# EAGLE schematic HomeHeat (EAGLE 9.6.2)
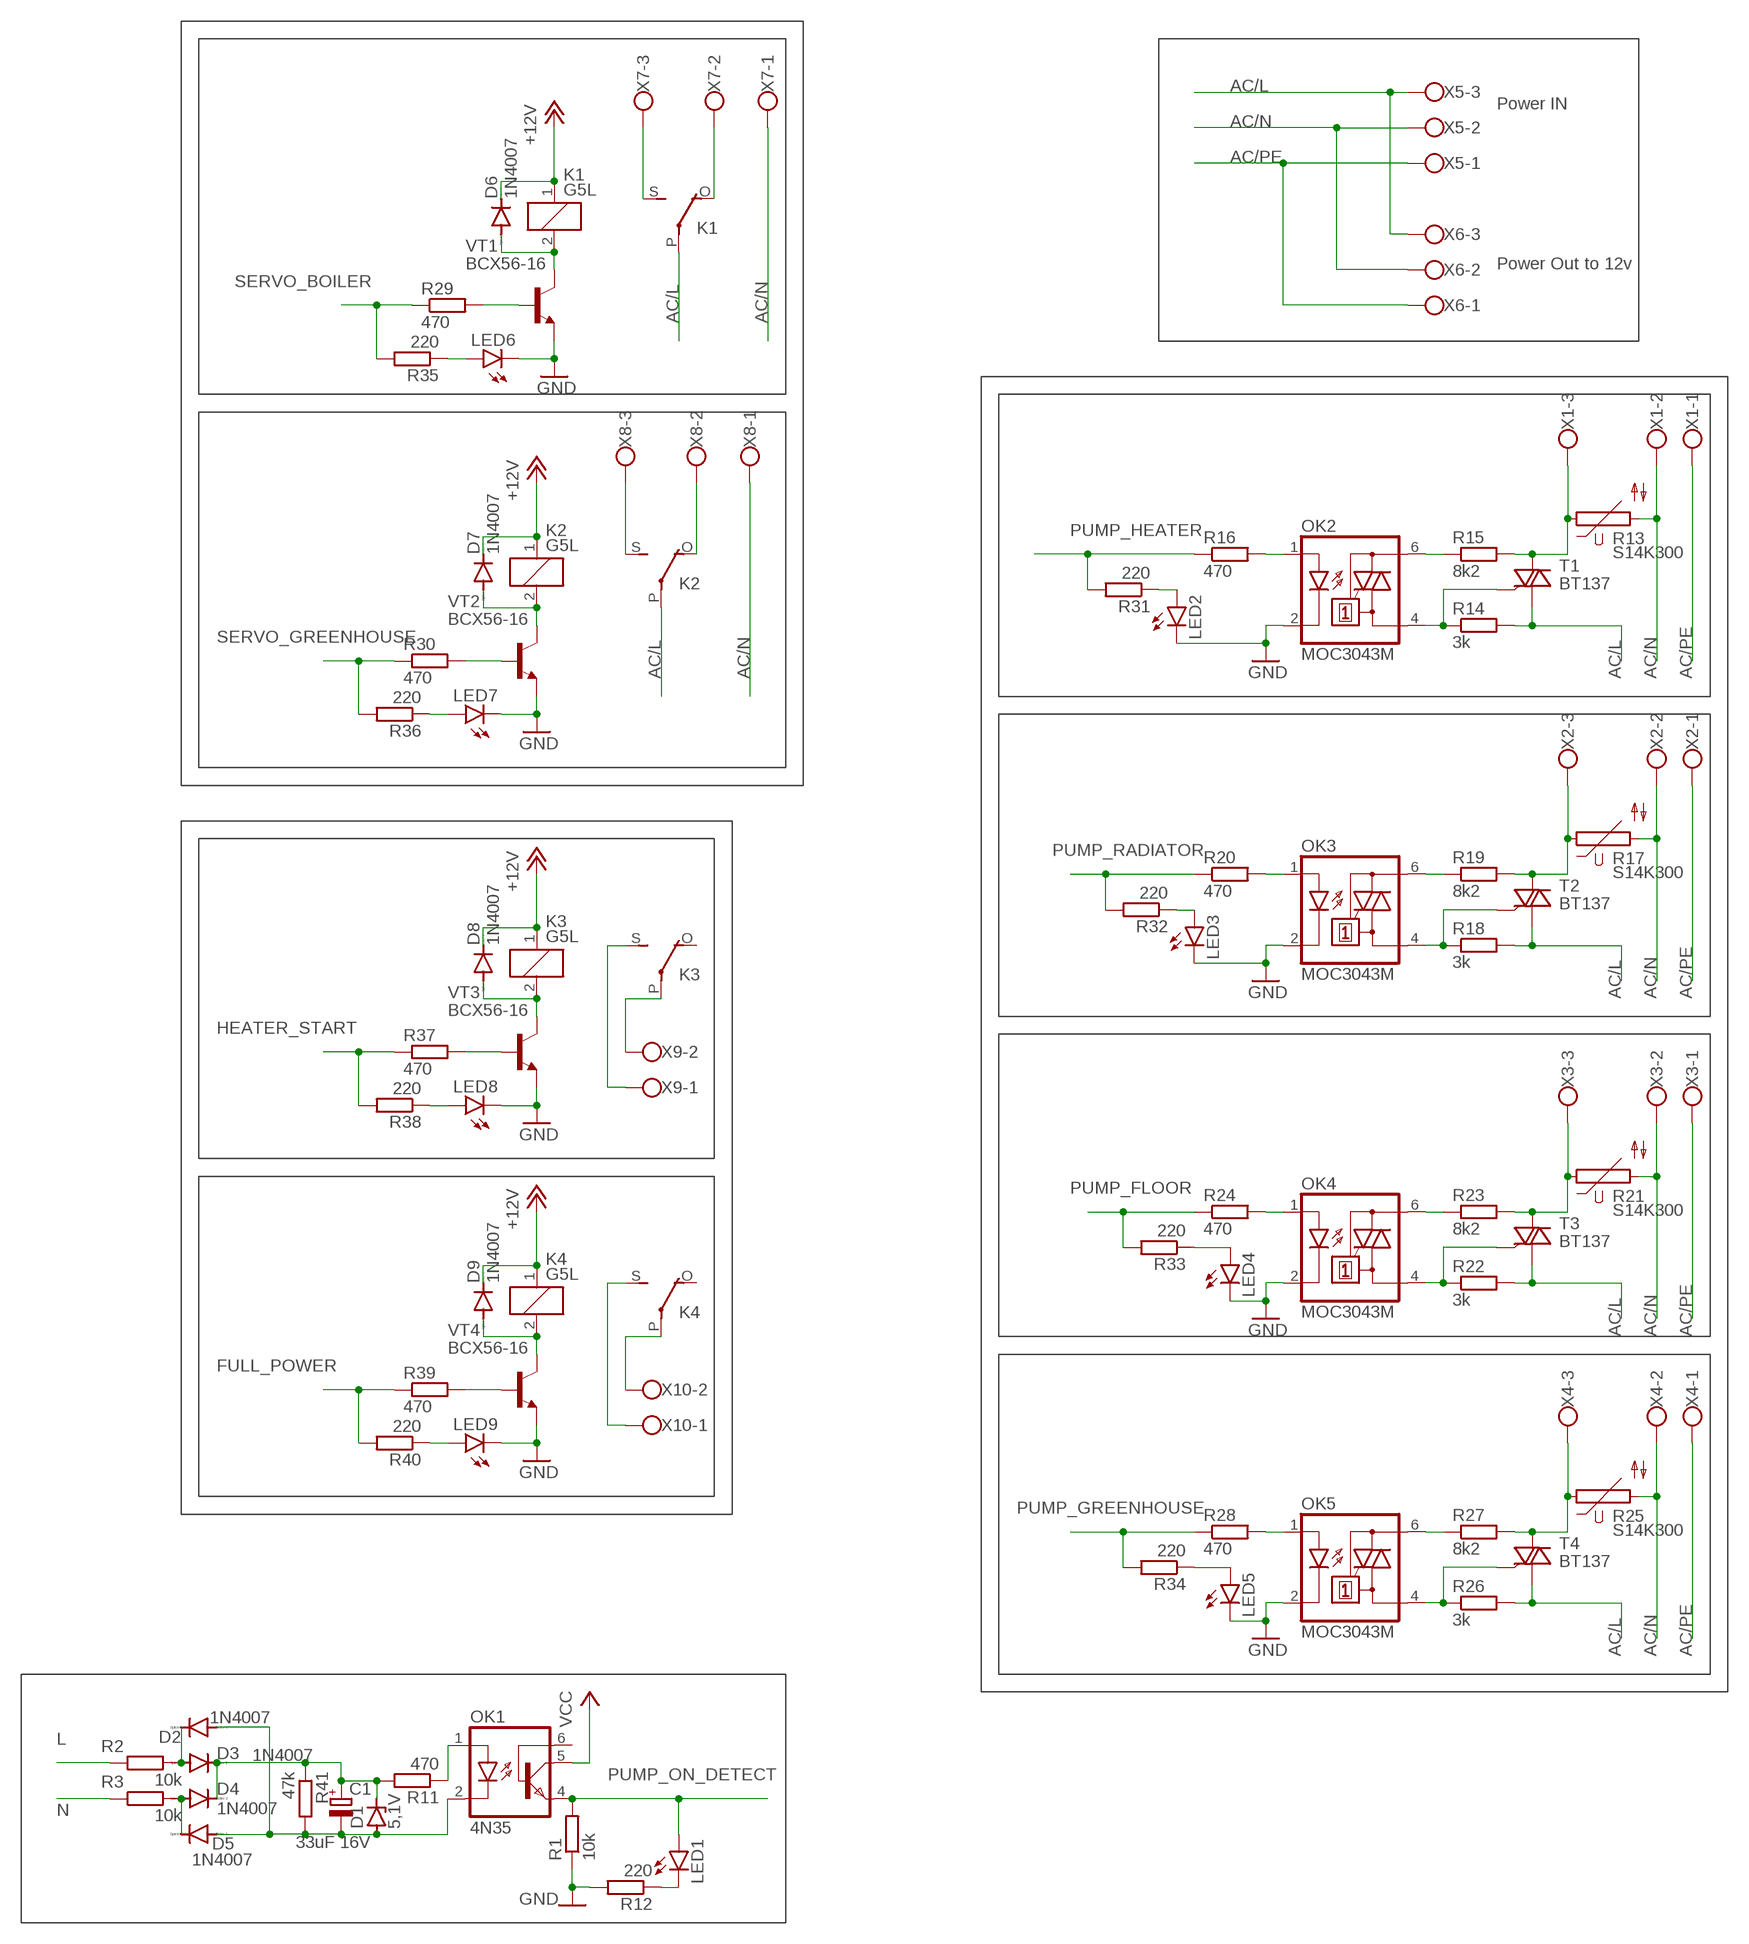
[diagram p0: schematic, sheet 1]

## Parts
C1  33uF 16V  CPOL-EUSMCA  [SMC_A]
D1  5,1V  ZENER-DIODEDO41Z10  [DO41Z10]
D2  1N4007  1N4004  [DO41-10]
D3  1N4007  1N4004  [DO41-10]
D4  1N4007  1N4004  [DO41-10]
D5  1N4007  1N4004  [DO41-10]
D6  1N4007  1N4004  [DO41-10]
D7  1N4007  1N4004  [DO41-10]
D8  1N4007  1N4004  [DO41-10]
D9  1N4007  1N4004  [DO41-10]
K1  G5L  [G5LE]
K2  G5L  [G5LE]
K3  G5L  [G5LE]
K4  G5L  [G5LE]
LED1  LEDCHIP-LED0805  [CHIP-LED0805]
LED2  LEDCHIP-LED0805  [CHIP-LED0805]
LED3  LEDCHIP-LED0805  [CHIP-LED0805]
LED4  LEDCHIP-LED0805  [CHIP-LED0805]
LED5  LEDCHIP-LED0805  [CHIP-LED0805]
LED6  LEDCHIP-LED0805  [CHIP-LED0805]
LED7  LEDCHIP-LED0805  [CHIP-LED0805]
LED8  LEDCHIP-LED0805  [CHIP-LED0805]
LED9  LEDCHIP-LED0805  [CHIP-LED0805]
OK1  4N35  [DIL06]
OK2  MOC3043M  [DIL06]
OK3  MOC3043M  [DIL06]
OK4  MOC3043M  [DIL06]
OK5  MOC3043M  [DIL06]
R1  10k  R-EU_R0805  [R0805]
R2  10k  R-EU_0922/22  [0922/22]
R3  10k  R-EU_0922/22  [0922/22]
R11  470  R-EU_R0805  [R0805]
R12  220  R-EU_R0805  [R0805]
R13  S14K300  [S14K300]
R14  3k  R-EU_0207/7  [0207/7]
R15  8k2  R-EU_0207/7  [0207/7]
R16  470  R-EU_R0805  [R0805]
R17  S14K300  [S14K300]
R18  3k  R-EU_0207/7  [0207/7]
R19  8k2  R-EU_0207/7  [0207/7]
R20  470  R-EU_R0805  [R0805]
R21  S14K300  [S14K300]
R22  3k  R-EU_0207/7  [0207/7]
R23  8k2  R-EU_0207/7  [0207/7]
R24  470  R-EU_R0805  [R0805]
R25  S14K300  [S14K300]
R26  3k  R-EU_0207/7  [0207/7]
R27  8k2  R-EU_0207/7  [0207/7]
R28  470  R-EU_R0805  [R0805]
R29  470  R-EU_R0805  [R0805]
R30  470  R-EU_R0805  [R0805]
R31  220  R-EU_R0805  [R0805]
R32  220  R-EU_R0805  [R0805]
R33  220  R-EU_R0805  [R0805]
R34  220  R-EU_R0805  [R0805]
R35  220  R-EU_R0805  [R0805]
R36  220  R-EU_R0805  [R0805]
R37  470  R-EU_R0805  [R0805]
R38  220  R-EU_R0805  [R0805]
R39  470  R-EU_R0805  [R0805]
R40  220  R-EU_R0805  [R0805]
R41  47k  R-EU_R0805  [R0805]
T1  BT137  BT136  [TO220AB]
T2  BT137  BT136  [TO220AB]
T3  BT137  BT136  [TO220AB]
T4  BT137  BT136  [TO220AB]
VT1  BCX56-16  [SOT89-BCE]
VT2  BCX56-16  [SOT89-BCE]
VT3  BCX56-16  [SOT89-BCE]
VT4  BCX56-16  [SOT89-BCE]
X1  W237-103  [W237-103]
X2  W237-103  [W237-103]
X3  W237-103  [W237-103]
X4  W237-103  [W237-103]
X5  W237-103  [W237-103]
X6  W237-103  [W237-103]
X7  W237-103  [W237-103]
X8  W237-103  [W237-103]
X9  W237-102  [W237-102]
X10  W237-102  [W237-102]

## Nets
+12V: D6.C D7.C D8.C D9.C K1.1 K2.1 K3.1 K4.1
AC/L: K1.P(2:P) K2.P(2:P) R14.2 R18.2 R22.2 R26.2 T1.1(A1) T2.1(A1) T3.1(A1) T4.1(A1) X5.3 X6.3
AC/N: R13.2 R17.2 R21.2 R25.2 X1.2 X2.2 X3.2 X4.2 X5.2 X6.2 X7.1 X8.1
AC/PE: X1.1 X2.1 X3.1 X4.1 X5.1 X6.1
FULL_POWER: R39.1 R40.2
GND: LED2.C LED3.C LED4.C LED5.C LED6.C LED7.C LED8.C LED9.C OK2.2(C) OK3.2(C) OK4.2(C) OK5.2(C) R1.1 R12.2 VT1.E VT2.E VT3.E VT4.E
HEATER_START: R37.1 R38.2
N$1: R2.1
N$2: R3.1
N$5: LED1.C R12.1
N$7: D2.C D3.A R2.2
N$8: D4.A D5.C R3.2
N$9: C1.- D1.A D2.A D5.A OK1.2(C) R41.2
N$10: C1.+ D1.C D3.C D4.C R11.2 R41.1
N$11: OK1.1(A) R11.1
N$13: D8.A K3.2 VT3.C VT3.C@1(C)
N$17: OK2.1(A) R16.2
N$18: OK2.6(A2) R15.1
N$19: R13.1 R15.2 T1.2(A2) X1.3
N$20: OK2.4(A1) R14.1 T1.3(G)
N$21: D6.A K1.2 VT1.C VT1.C@1(C)
N$22: OK3.1(A) R20.2
N$23: OK3.6(A2) R19.1
N$24: R17.1 R19.2 T2.2(A2) X2.3
N$25: OK3.4(A1) R18.1 T2.3(G)
N$26: R29.2 VT1.B
N$27: OK4.1(A) R24.2
N$28: OK4.6(A2) R23.1
N$29: R21.1 R23.2 T3.2(A2) X3.3
N$30: OK4.4(A1) R22.1 T3.3(G)
N$31: LED2.A R31.1
N$32: OK5.1(A) R28.2
N$33: OK5.6(A2) R27.1
N$34: R25.1 R27.2 T4.2(A2) X4.3
N$35: OK5.4(A1) R26.1 T4.3(G)
N$36: D7.A K2.2 VT2.C VT2.C@1(C)
N$37: K1.S(2:S) X7.3
N$38: K1.O(2:O) X7.2
N$39: R30.2 VT2.B
N$40: LED3.A R32.1
N$41: K2.S(2:S) X8.3
N$42: K2.O(2:O) X8.2
N$43: LED4.A R33.1
N$44: LED5.A R34.1
N$45: LED6.A R35.1
N$46: LED7.A R36.1
N$47: R37.2 VT3.B
N$48: K3.P(2:P) X9.2
N$49: K3.S(2:S) X9.1
N$50: LED8.A R38.1
N$51: D9.A K4.2 VT4.C VT4.C@1(C)
N$52: R39.2 VT4.B
N$53: LED9.A R40.1
N$54: K4.P(2:P) X10.2
N$55: K4.S(2:S) X10.1
PUMP_FLOOR: R24.1 R33.2
PUMP_GREENHOUSE: R28.1 R34.2
PUMP_HEATER: R16.1 R31.2
PUMP_ON_DETECT: LED1.A OK1.4(EMI) R1.2
PUMP_RADIATOR: R20.1 R32.2
SERVO_BOILER: R29.1 R35.2
SERVO_GREENHOUSE: R30.1 R36.2
VCC: OK1.5(COL)
Unconnected: K3.O(2:O) K4.O(2:O) OK1.6(BAS)

## Notes on the sheet
- Power IN
- Power Out to 12v
- L
- N

## Library data of the parts
C1 = rcl:CPOL-EU: POLARIZED CAPACITOR, European symbol; SPICEPREFIX: C
D1 = diode:ZENER-DIODE: Z-Diode
D2 D3 D5-D9 = diode:1N4004: DIODE general purpose rectifier, 1 A
D4 = diode:1N4004: DIODE general purpose rectifier, 1 A; SPICEPREFIX: D
K1-K4 = relay:G5L: RELAY 1 x switch, 10 A/120 V AC, 8 A/30 V ADC, Omron; OC_FARNELL: unknown; OC_NEWARK: unknown
LED1-LED9 = led:LED: LED OSRAM: - CHIPLED LG R971, LG N971, LY N971, LG Q971, LY Q971, LO R971, LY R971 LH N974, LH R974 LS Q976, LO Q976, LY Q976 LO Q996 - Hyper CHIPLED LW Q18S LB Q993, LB Q99A, LB R99A - SideLED LS A670, LO A670, LY A670, LG A670, LP A670 LB A673, LV A673, LT A673, LW A673 LH A674 LY A675 LS A676, LA A676, LO A676, LY A676, LW A676 LS A679, LY A679, LG A679 - Hyper Micro SIDELED® LS Y876, LA Y876, LO Y876, LY Y876 LT Y87S - SmartLED LW L88C, LW L88S LB L89C, LB L89S, LG L890 LS L89K, LO L89K, LY L89K LS L896, LA L896, LO L896, LY L896 - TOPLED LS T670, LO T670, LY T670, LG T670, LP T670 LSG T670, LSP T670, LSY T670, LOP T670, LYG T670 LG T671, LOG T671, LSG T671 LB T673, LV T673, LT T673, LW T673 LH T674 LS T676, LA T676, LO T676, LY T676, LB T676, LH T676, LSB T676, LW T676 LB T67C, LV T67C, LT T67C, LS T67K, LO T67K, LY T67K, LW E67C LS E67B, LA E67B, LO E67B, LY E67B, LB E67C, LV E67C, LT E67C LW T67C LS T679, LY T679, LG T679 LS T770, LO T770, LY T770, LG T770, LP T770 LB T773, LV T773, LT T773, LW T773 LH T774 LS E675, LA E675, LY E675, LS T675 LS T776, LA T776, LO T776, LY T776, LB T776 LHGB T686 LT T68C, LB T68C - Hyper Mini TOPLED® LB M676 - Mini TOPLED Santana® LG M470 LS M47K, LO M47K, LY M47K Source: http://www.osram.convergy.de LUXEON: - LUMILED® LXK2-PW12-R00, LXK2-PW12-S00, LXK2-PW14-U00, LXK2-PW14-V00 LXK2-PM12-R00, LXK2-PM12-S00, LXK2-PM14-U00 LXK2-PE12-Q00, LXK2-PE12-R00, LXK2-PE12-S00, LXK2-PE14-T00, LXK2-PE14-U00 LXK2-PB12-K00, LXK2-PB12-L00, LXK2-PB12-M00, LXK2-PB14-N00, LXK2-PB14-P00, LXK2-PB14-Q00 LXK2-PR12-L00, LXK2-PR12-M00, LXK2-PR14-Q00, LXK2-PR14-R00 LXK2-PD12-Q00, LXK2-PD12-R00, LXK2-PD12-S00 LXK2-PH12-R00, LXK2-PH12-S00 LXK2-PL12-P00, LXK2-PL12-Q00, LXK2-PL12-R00 Source: www.luxeon.com KINGBRIGHT: KA-3528ASYC Source: www.kingbright.com
OK1 = optocoupler:4N35: MOTOROLA OPTO COUPLER; MF: FAIRCHILD SEMICONDUCTOR; MPN: 4N35; OC_FARNELL: 1328375; OC_NEWARK: 72K9946
OK2-OK5 = optocoupler:MOC30*: 6-Pin DIP Zero-Cross Optoisolators Triac Driver Output (250/400 Volt Peak) Source: Data sheet <http://www.fairchildsemi.com/ds/MO/MOC3031M.pdf> The old path of data sheet not more available 2013-05-06.; MF: FAIRCHILD SEMICONDUCTOR; MPN: MOC3043-M; OC_FARNELL: 1021371; OC_NEWARK: 72K8900
R1-R3 R11 R12 R14-R16 R18-R20 R22-R24 R26-R41 = rcl:R-EU_: RESISTOR, European symbol; SPICEPREFIX: R
R13 R17 R21 R25 = varistor:S14K300: VARISTOR
T1-T4 = triac:BT136: Triac BT136 series E sensitive gate Source: http://www.nxp.com/acrobat_download/datasheets/BT136_SERIES_E_2.pdf
VT1-VT4 = usb:BCX56-16
X1-X8 = con-wago-500:W237-103: WAGO SCREW CLAMP; MPN: 237-103; OC_FARNELL: unknown; OC_NEWARK: 18M7116
X9 X10 = con-wago-500:W237-102: WAGO SCREW CLAMP; MPN: 237-102; OC_FARNELL: unknown; OC_NEWARK: 70K9898